# Altium schematic sheet DDS_AD9854.SchDoc
size A4
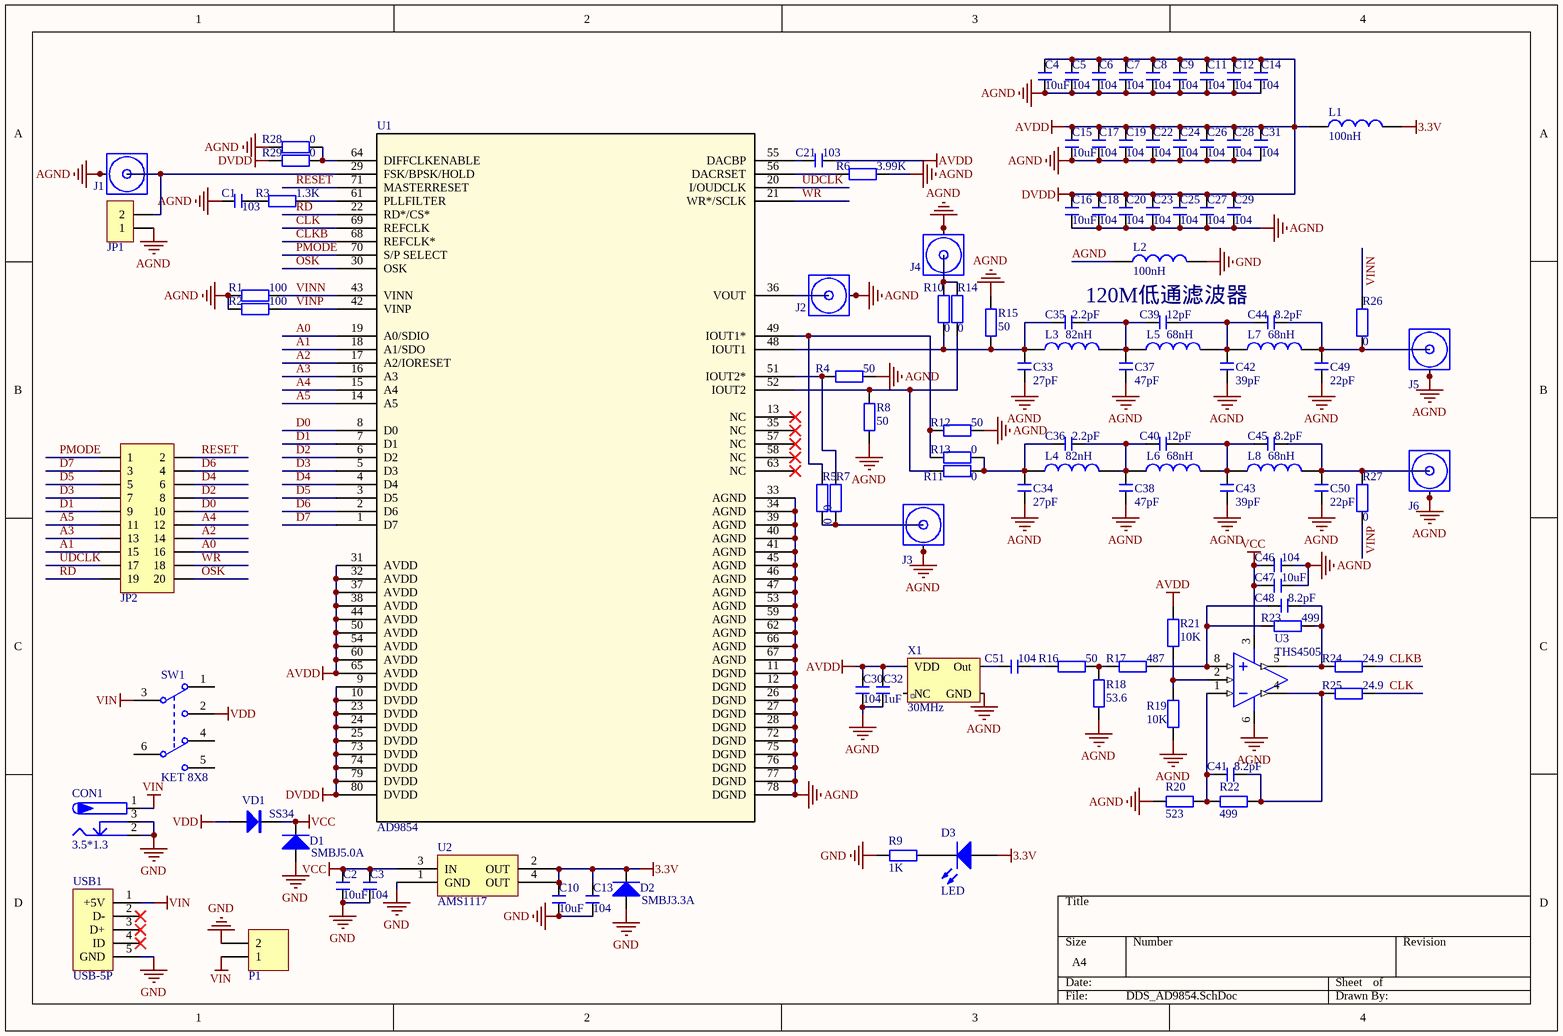
[diagram p0: DDS_AD9854.SchDoc]

## Parts
C1  103  [C 0603]
C2  10uF  [C 0805]
C3  104  [C 0603]
C4  10uF  [C 0603]
C5  104  [C 0603]
C6  104  [C 0603]
C7  104  [C 0603]
C8  104  [C 0603]
C9  104  [C 0603]
C10  10uF  [C 0603]
C11  104  [C 0603]
C12  104  [C 0603]
C13  104  [C 0603]
C14  104  [C 0603]
C15  10uF  [C 0603]
C16  10uF  [C 0603]
C17  104  [C 0603]
C18  104  [C 0603]
C19  104  [C 0603]
C20  104  [C 0603]
C21  103  [C 0603]
C22  104  [C 0603]
C23  104  [C 0603]
C24  104  [C 0603]
C25  104  [C 0603]
C26  104  [C 0603]
C27  104  [C 0603]
C28  104  [C 0603]
C29  104  [C 0603]
C30  104  [C 0603]
C31  104  [C 0603]
C32  1uF  [C 0603]
C33  27pF  [C 0603]
C34  27pF  [C 0603]
C35  2.2pF  [C 0603]
C36  2.2pF  [C 0603]
C37  47pF  [C 0603]
C38  47pF  [C 0603]
C39  12pF  [C 0603]
C40  12pF  [C 0603]
C41  8.2pF  [C 0603]
C42  39pF  [C 0603]
C43  39pF  [C 0603]
C44  8.2pF  [C 0603]
C45  8.2pF  [C 0603]
C46  104  [C 0603]
C47  10uF  [C 0603]
C48  8.2pF  [C 0603]
C49  22pF  [C 0603]
C50  22pF  [C 0603]
C51  104  [C 0603]
CON1  3.5*1.3  [DC-005]
D1  Type: SMBJ5.0A  [SMB]  (hidden comment: TVS)
D2  Type: SMBJ3.3A  [SMB]  (hidden comment: TVS)
D3  LED  [LED_0805]
J1  COAX  [MCX5.08-5-H]  (value not drawn)
J2  COAX  [MCX5.08-5-H]  (value not drawn)
J3  COAX  [MCX5.08-5-H]  (value not drawn)
J4  COAX  [MCX5.08-5-H]  (value not drawn)
J5  COAX  [MCX5.08-5-H]  (value not drawn)
J6  COAX  [MCX5.08-5-H]  (value not drawn)
JP1  HDR-1X2  [HDR-1X2]  (value not drawn)
JP2  Header 2X10  [HDR-10X2]  (value not drawn)
L1  100nH  [L 0805]
L2  100nH  [L 0805]
L3  82nH  [L 0603]
L4  82nH  [L 0603]
L5  68nH  [L 0603]
L6  68nH  [L 0603]
L7  68nH  [L 0603]
L8  68nH  [L 0603]
P1  Header 2  [HDR2X1_B2]  (value not drawn)
R1  100  [R 0603]
R2  100  [R 0603]
R3  1.3K  [R 0603]
R4  50  [R 0603]
R5  0  [R 0402]
R6  3.99K  [R 0603]
R7  0  [R 0402]
R8  50  [R 0603]
R9  1K  [R 0603]
R10  0  [R 0402]
R11  0  [R 0402]
R12  50  [R 0603]
R13  0  [R 0402]
R14  0  [R 0402]
R15  50  [R 0603]
R16  50  [R 0603]
R17  487  [R 0603]
R18  53.6  [R 0603]
R19  10K  [R 0603]
R20  523  [R 0603]
R21  10K  [R 0603]
R22  499  [R 0603]
R23  499  [R 0603]
R24  24.9  [R 0603]
R25  24.9  [R 0603]
R26  0  [R 0402]
R27  0  [R 0402]
R28  0  [R 0402]
R29  0  [R 0402]
SW1  KET 8X8  [KFT DIP-8X8]
U1  AD9854  [LQFP-80_N]
U2  AMS1117  [SOT223_N]
U3  THS4505  [MSOP-MS8_M]
USB1  USB-5P  [USB-MICRO_B]
VD1  SS34  [DIODE-SMA]
X1  Frequency: 30MHz  [X-CPX75]  (hidden comment: XTAL)

## Nets
3.3V: C10.2 C13.2 D2.2(K) D3.1(A) L1.2 U2.2(OUT) U2.4(OUT)
AGND: C1.1 C4.1 C5.1 C6.1 C7.1 C8.1 C9.1 C11.1 C12.1 C14.1 C15.1 C16.1 C17.1 C18.1 C19.1 C20.1 C22.1 C23.1 C24.1 C25.1 C26.1 C27.1 C28.1 C29.1 C30.1 C31.1 C32.1 C33.1 C34.1 C37.2 C38.2 C42.1 C43.1 C46.1 C47.1 C49.2 C50.2 J1.2(GND) J1.3(GND) J1.4(GND) J1.5(GND) J2.2(GND) J2.3(GND) J2.4(GND) J2.5(GND) J3.2(GND) J3.3(GND) J3.4(GND) J3.5(GND) J4.2(GND) J4.3(GND) J4.4(GND) J4.5(GND) J5.2(GND) J5.3(GND) J5.4(GND) J5.5(GND) J6.2(GND) J6.3(GND) J6.4(GND) J6.5(GND) JP1.1 L2.1 R1.2 R2.2 R4.1 R6.2 R8.2 R12.1 R15.2 R18.2 R19.2 R20.2 R28.1 U1.11(DGND) U1.12(DGND) U1.26(DGND) U1.27(DGND) U1.28(DGND) U1.33(AGND) U1.34(AGND) U1.39(AGND) U1.40(AGND) U1.41(AGND) U1.45(AGND) U1.46(AGND) U1.47(AGND) U1.53(AGND) U1.59(AGND) U1.62(AGND) U1.66(AGND) U1.67(AGND) U1.72(DGND) U1.75(DGND) U1.76(DGND) U1.77(DGND) U1.78(DGND) U3.6(VS-) X1.2(GND)
AVDD: C4.2 C5.2 C6.2 C7.2 C8.2 C9.2 C11.2 C12.2 C14.2 C15.2 C16.2 C17.2 C18.2 C19.2 C20.2 C21.2 C22.2 C23.2 C24.2 C25.2 C26.2 C27.2 C28.2 C29.2 C30.2 C31.2 C32.2 L1.1 R21.1 R29.1 U1.9(DVDD) U1.10(DVDD) U1.23(DVDD) U1.24(DVDD) U1.25(DVDD) U1.31(AVDD) U1.32(AVDD) U1.37(AVDD) U1.38(AVDD) U1.44(AVDD) U1.50(AVDD) U1.54(AVDD) U1.60(AVDD) U1.65(AVDD) U1.73(DVDD) U1.74(DVDD) U1.79(DVDD) U1.80(DVDD) X1.4(VDD)  [also labelled DVDD]
GND: C2.1 C3.1 C10.1 C13.1 CON1.2 CON1.3 D1.1(A) D2.1(A) L2.2 P1.2 R9.2 U2.1(GND) USB1.5(GND)
VCC: C2.2 C3.2 C46.2 C47.2 D1.2(K) U2.3(IN) U3.3(VS+) VD1.2(K)
VDD: SW1.2(COM2) VD1.1(A)
VIN: CON1.1 P1.1 SW1.3(NO1) USB1.1(+5V)
A0: JP2.16 U1.19(A0/SDIO)
A1: JP2.15 U1.18(A1/SDO)
A2: JP2.14 U1.17(A2/IORESET)
A3: JP2.13 U1.16(A3)
A4: JP2.12 U1.15(A4)
A5: JP2.11 U1.14(A5)
CLK: R25.1 U1.69(REFCLK)
CLKB: R24.1 U1.68(REFCLK*)
D0: JP2.10 U1.8(D0)
D1: JP2.9 U1.7(D1)
D2: JP2.8 U1.6(D2)
D3: JP2.7 U1.5(D3)
D4: JP2.6 U1.4(D4)
D5: JP2.5 U1.3(D5)
D6: JP2.4 U1.2(D6)
D7: JP2.3 U1.1(D7)
OSK: JP2.20 U1.30(OSK)
PMODE: JP2.1 U1.70(S/P_SELECT)
RD: JP2.19 U1.22(RD*/CS*)
RESET: JP2.2 U1.71(MASTERRESET)
UDCLK: JP2.17 U1.20(I/OUDCLK)
VINN: R1.1 R26.2 U1.43(VINN)
VINP: R2.1 R27.1 U1.42(VINP)
WR: JP2.18 U1.21(WR*/SCLK)
NetC1_2: C1.2 R3.1
NetC21_1: C21.1 U1.55(DACBP)
NetC33_2: C33.2 C35.2 L3.1 R10.1 R15.1 U1.48(IOUT1)
NetC34_2: C34.2 C36.2 L4.1 R11.1 R13.1
NetC35_1: C35.1 C37.1 C39.1 L3.2 L5.1
NetC36_1: C36.1 C38.1 C40.1 L4.2 L6.1
NetC39_2: C39.2 C42.2 C44.2 L5.2 L7.1
NetC40_2: C40.2 C43.2 C45.2 L6.2 L8.1
NetC41_1: C41.1 R22.1 R25.2 U3.4(VOUT+)
NetC41_2: C41.2 R20.1 R22.2 U3.1(-IN)
NetC44_1: C44.1 C49.1 J5.1(Signal) L7.2 R26.1
NetC45_1: C45.1 C50.1 J6.1(Signal) L8.2 R27.2
NetC48_1: C48.1 R23.1 R24.2 U3.5(VOUT-)
NetC48_2: C48.2 R17.1 R23.2 U3.8(+IN)
NetC51_1: C51.1 R16.2
NetC51_2: C51.2 X1.3(Out)
NetD3_2: D3.2(K) R9.1
NetJ1_1: J1.1(Signal) JP1.2 U1.29(FSK/BPSK/HOLD)
NetJ2_1: J2.1(Signal) U1.36(VOUT)
NetJ3_1: J3.1(Signal) R5.1 R7.1
NetJ4_1: J4.1(Signal) R10.2 R14.2
NetR3_2: R3.2 U1.61(PLLFILTER)
NetR4_2: R4.2 R7.2 U1.51(IOUT2*)
NetR5_2: R5.2 R12.2 R13.2 U1.49(IOUT1*)
NetR6_1: R6.1 U1.56(DACRSET)
NetR8_1: R8.1 R11.2 R14.1 U1.52(IOUT2)
NetR16_1: R16.1 R17.2 R18.1
NetR19_1: R19.1 R21.2 U3.2(+IN)
NetR28_2: R28.2 R29.2 U1.64(DIFFCLKENABLE)

Not connected (* = marked no-connect by the designer): SW1 1(NC1) 4(NO2) 5(COM2) 6(NC2); U1 13(NC)* 35(NC)* 57(NC)* 58(NC)* 63(NC)*; USB1 2(D-)* 3(D+)* 4(ID)*; X1 1(NC)

## Notes on the sheet
- 120M低通滤波器

## Library data of the parts
C1-C51 = C: 无极性贴片电容; 版权归属: 源创客; BOM名称: 无极性贴片电容; 学习资源: www.ooocke.com
CON1 = P-DC: 低压电源接口; BOM名称: DC电源接口; 版权归属: 源创客; 学习资源: www.ooocke.com
D1 D2 = TVS: TVS保护; Published: 8-Jun-2000; LatestRevisionDate: 17-Jul-2002; LatestRevisionNote: Re-released for DXP Platform.; PackageDocument: Sep-1996; PackageReference: SMC; Publisher: Altium Limited; Code_JEDEC: DO-214-AB
D3 = LED: 发光二极管; Published: 8-Jun-2000; LatestRevisionDate: 08-Jul-2005; LatestRevisionNote: Mech Layer 1 removed.; PackageReference: LED; Publisher: Altium Limited
JP1 = Header 2: 2P接插件; 版权归属: 源创客; BOM名称: 2P接插件; 学习资源: www.ooocke.com
JP2 = Header 10X2: 10*2P接插件; 版权归属: 源创客; BOM名称: 10*2P接插件; 学习资源: www.ooocke.com
L1-L8 = L: 小功率贴片电感; 版权归属: 源创客; BOM名称: 小功率贴片电感; 学习资源: www.ooocke.com
P1 = Header 2: 接插件; LatestRevisionDate: 17-Jul-2002; LatestRevisionNote: Re-released for DXP Platform.; Publisher: Altium Limited
R1-R29 = R: 贴片电阻; 版权归属: 源创客; BOM名称: 贴片电阻; 学习资源: www.ooocke.com
SW1 = KET 8X8: 8*8自锁开关; 版权归属: 源创客; BOM名称: 8*8自锁开关; 学习资源: www.ooocke.com
U1 = AD9854: DDS; Manufacturer_Part_Number: AD9854ASTZ; Vendor: Vendor; RefDes: RefDes; Type: DEV; Value: Value
U2 = ASM1117: 线性稳压芯片
U3 = THS4505: WIDEBAND, LOW-DISTORTION,FULLY DIFFERENTIAL AMPLIFIERS
USB1 = USB-5P: 微型USB母座; 版权归属: 源创客; BOM名称: 微型USB母座; 学习资源: www.ooocke.com
VD1 = SS34: 肖特基二极管; 版权归属: 源创客; 属性: 40V/3A; BOM名称: 肖特基二极管; 学习资源: www.ooocke.com
X1 = XTAL_Oscillator: 有源晶振